# Altium schematic sheet Board baru V.3.SchDoc
size A3
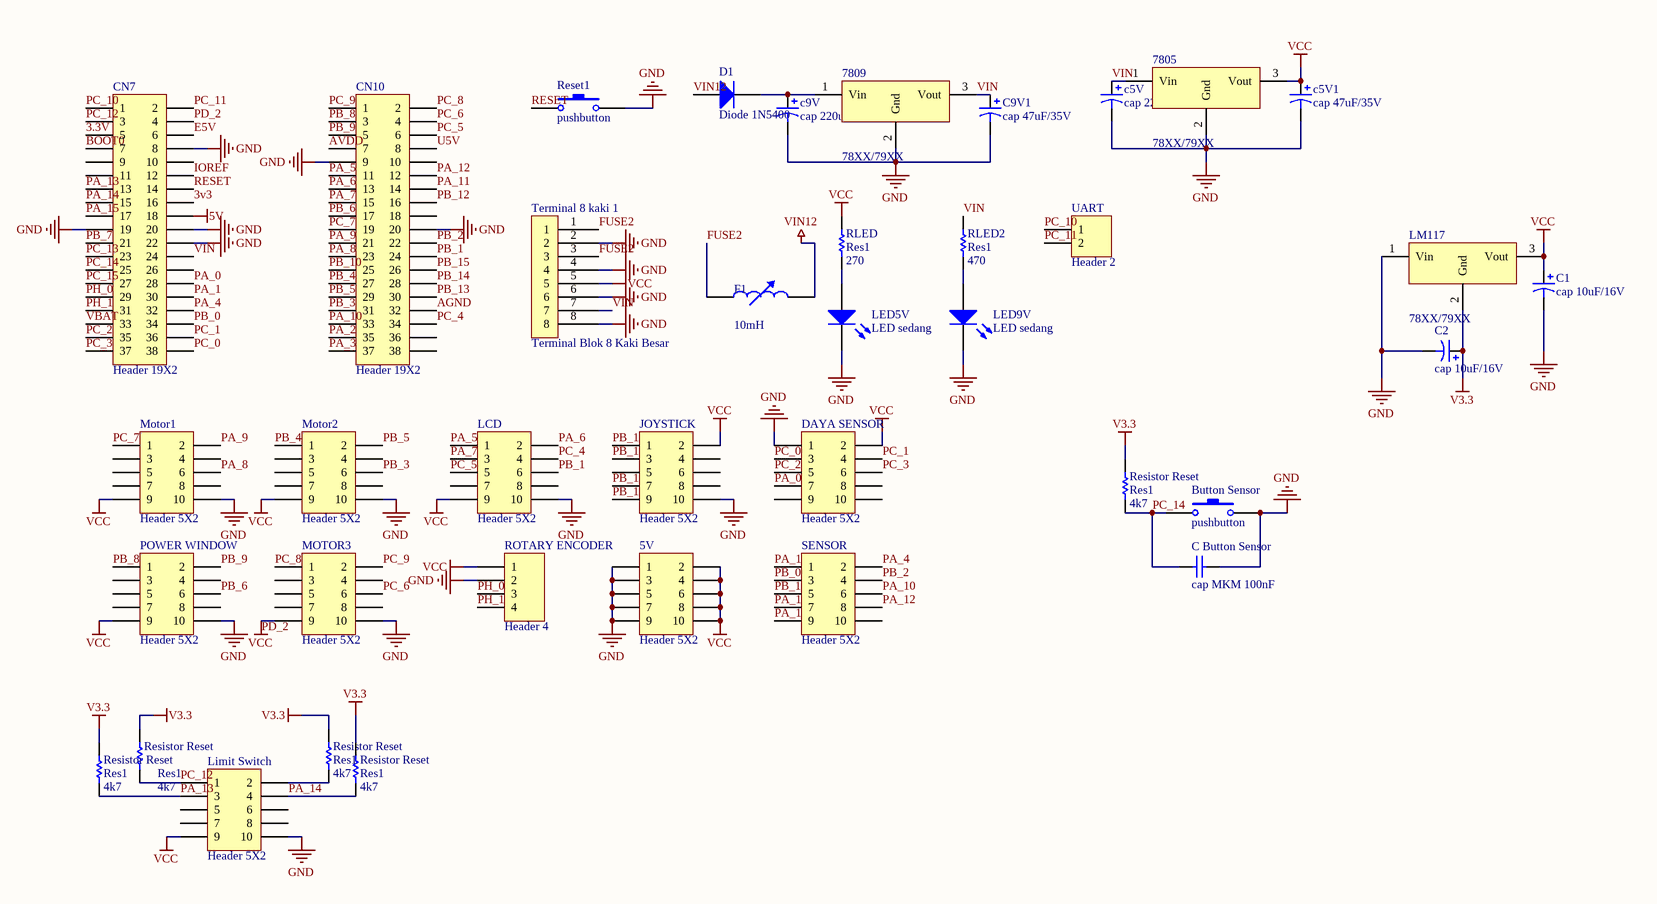
[diagram p0: Board baru V.3.SchDoc]

## Parts
(Parts that share a designator on the sheet are numbered #1, #2 ... from top to bottom, then left to right.)
5V  Header 5X2  [HDR2X5]
7805  78XX/79XX  [78XX/79XX diri]
7809  78XX/79XX  [78XX/79XX]
Button_Sensor  pushbutton  [pushbutton]
C1  cap 10uF/16V  [cap 10uF/16V]
C2  cap 10uF/16V  [cap 10uF/16V]
c5V  cap 220uF/16V  [cap 220uF/16V]
c5V1  cap 47uF/35V  [cap 220uF/16V]
c9V  cap 220uF/50V  [cap 1uF/50V]
C9V1  cap 47uF/35V  [cap 1uF/50V]
C_Button_Sensor  cap MKM 100nF  [cap MKM 100nF diri]
CN7  Header 19X2  [HDR2X19]
CN10  Header 19X2  [HDR2X19]
D1  Diode 1N5400  [DO-201AD]
DAYA_SENSOR  Header 5X2  [HDR2X5]
F1  value 10mH  [AXIAL-0.8]  (hidden comment: Inductor Adj)
JOYSTICK  Header 5X2  [HDR2X5]
LCD  Header 5X2  [HDR2X5]
LED5V  LED sedang  [LED sedang]
LED9V  LED sedang  [LED sedang]
Limit_Switch  Header 5X2  [HDR2X5]
LM117  78XX/79XX  [78XX/79XX]
Motor1  Header 5X2  [HDR2X5]
Motor2  Header 5X2  [HDR2X5]
MOTOR3  Header 5X2  [HDR2X5]
POWER_WINDOW  Header 5X2  [HDR2X5]
Reset1  pushbutton  [pushbutton]
Resistor_Reset#1  Res1  value 4k7  [AXIAL-0.3]
Resistor_Reset#2  Res1  value 4k7  [AXIAL-0.3]
Resistor_Reset#3  Res1  value 4k7  [AXIAL-0.3]
Resistor_Reset#4  Res1  value 4k7  [AXIAL-0.3]
Resistor_Reset#5  Res1  value 4k7  [AXIAL-0.3]
RLED  Res1  value 270  [AXIAL-0.3]
RLED2  Res1  value 470  [AXIAL-0.3]
ROTARY_ENCODER  Header 4  [HDR1X4]
SENSOR  Header 5X2  [HDR2X5]
Terminal_8_kaki_1  Terminal Blok 8 Kaki Besar  [TERMINAL 8 KAKI]
UART  Header 2  [HDR1X2]

## Nets
5V: CN7.18
GND: 5V.1 5V.3 5V.5 5V.7 5V.9 7805.2(Gnd) 7809.2(Gnd) Button_Sensor.2 C1.2 C2.2 c5V.2 c5V1.2 c9V.2 C9V1.2 C_Button_Sensor.2 CN7.8 CN7.19 CN7.20 CN7.22 CN10.9 CN10.20 DAYA_SENSOR.1 JOYSTICK.10 LCD.10 LED5V.2(K) LED9V.2(K) Limit_Switch.10 LM117.1(Vin) Motor1.10 Motor2.10 MOTOR3.10 POWER_WINDOW.10 Reset1.2 ROTARY_ENCODER.2 Terminal_8_kaki_1.2 Terminal_8_kaki_1.4 Terminal_8_kaki_1.6 Terminal_8_kaki_1.8
V3.3: C2.1 LM117.2(Gnd) Resistor_Reset#1.2 Resistor_Reset#2.2 Resistor_Reset#3.2 Resistor_Reset#4.2 Resistor_Reset#5.2
VCC: 5V.2 5V.4 5V.6 5V.8 5V.10 7805.3(Vout) C1.1 c5V1.1 DAYA_SENSOR.2 JOYSTICK.2 LCD.9 Limit_Switch.9 LM117.3(Vout) Motor1.9 Motor2.9 MOTOR3.9 POWER_WINDOW.9 RLED.2 ROTARY_ENCODER.1 Terminal_8_kaki_1.5
VIN12: D1.1(A) F1.2
3.3V: CN7.5
3v3: CN7.16
AGND: CN10.32
AVDD: CN10.7
BOOT0: CN7.7
E5V: CN7.6
FUSE2: F1.1 Terminal_8_kaki_1.1 Terminal_8_kaki_1.3
IOREF: CN7.12
PA_0: CN7.28 DAYA_SENSOR.7
PA_1: CN7.30 SENSOR.1
PA_2: CN10.35
PA_3: CN10.37
PA_4: CN7.32 SENSOR.2
PA_5: CN10.11 LCD.1
PA_6: CN10.13 LCD.2
PA_7: CN10.15 LCD.3
PA_8: CN10.23 Motor1.6
PA_9: CN10.21 Motor1.2
PA_10: CN10.33 SENSOR.6
PA_11: CN10.14 SENSOR.7
PA_12: CN10.12 SENSOR.8
PA_13: CN7.13 Limit_Switch.3 Resistor_Reset#4.1
PA_14: CN7.15 Limit_Switch.4 Resistor_Reset#5.1
PA_15: CN7.17 SENSOR.9
PB_0: CN7.34 SENSOR.3
PB_1: CN10.24 LCD.6
PB_2: CN10.22 SENSOR.4
PB_3: CN10.31 Motor2.6
PB_4: CN10.27 Motor2.1
PB_5: CN10.29 Motor2.2
PB_6: CN10.17 POWER_WINDOW.6
PB_7: CN7.21
PB_8: CN10.3 POWER_WINDOW.1
PB_9: CN10.5 POWER_WINDOW.2
PB_10: CN10.25 SENSOR.5
PB_12: CN10.16 JOYSTICK.3
PB_13: CN10.30 JOYSTICK.7
PB_14: CN10.28 JOYSTICK.9
PB_15: CN10.26 JOYSTICK.1
PC_0: CN7.38 DAYA_SENSOR.3
PC_1: CN7.36 DAYA_SENSOR.4
PC_2: CN7.35 DAYA_SENSOR.5
PC_3: CN7.37 DAYA_SENSOR.6
PC_4: CN10.34 LCD.4
PC_5: CN10.6 LCD.5
PC_6: CN10.4 MOTOR3.6
PC_7: CN10.19 Motor1.1
PC_8: CN10.2 MOTOR3.1
PC_9: CN10.1 MOTOR3.2
PC_10: CN7.1 UART.1
PC_11: CN7.2 UART.2
PC_12: CN7.3 Limit_Switch.1 Resistor_Reset#2.1
PC_13: CN7.23
PC_14: Button_Sensor.1 C_Button_Sensor.1 CN7.25 Resistor_Reset#1.1
PC_15: CN7.27
PD_2: CN7.4
PH_0: CN7.29 ROTARY_ENCODER.3
PH_1: CN7.31 ROTARY_ENCODER.4
RESET: CN7.14 Reset1.1
U5V: CN10.8
VBAT: CN7.33
VIN: 7805.1(Vin) 7809.3(Vout) c5V.1 C9V1.1 CN7.24 RLED2.2 Terminal_8_kaki_1.7
Net7809_1: 7809.1(Vin) c9V.1 D1.2(K)
NetLED5V_1: LED5V.1(A) RLED.1
NetLED9V_1: LED9V.1(A) RLED2.1
NetLimit_Switch_2: Limit_Switch.2 Resistor_Reset#3.1

Not connected (* = marked no-connect by the designer): CN7 9 10 11 26; CN10 10 18 36 38; DAYA_SENSOR 8 9 10; JOYSTICK 4 5 6 8; LCD 7 8; Limit_Switch 5 6 7 8; Motor1 3 4 5 7 8; Motor2 3 4 5 7 8; MOTOR3 3 4 5 7 8; POWER_WINDOW 3 4 5 7 8; SENSOR 10

## Notes on the sheet
- Labels drawn without touching a wire or pin: PD_2
- Title
- Size:
- Date:
- A3
- Number:
- Time:
- Revision:
- Sheet
- of
- File:

## Library data of the parts
5V DAYA_SENSOR JOYSTICK LCD Limit_Switch Motor1 Motor2 MOTOR3 POWER_WINDOW SENSOR = Header 5X2: Header, 5-Pin, Dual row; LatestRevisionDate: 17-Jul-2002; LatestRevisionNote: Re-released for DXP Platform.; Publisher: Altium Limited
7805 7809 LM117 = 7805/7809/7812/7905/7909/7912
c5V1 = cap 220uF/16V
c9V C9V1 = cap 1uF/50V
CN7 CN10 = Header 19X2: Header, 19-Pin, Dual row; LatestRevisionDate: 17-Jul-2002; LatestRevisionNote: Re-released for DXP Platform.; Publisher: Altium Limited
D1 = Diode 1N5400: 3 Amp General Purpose Rectifier; Published: 8-Jun-2000; LatestRevisionDate: 17-Jul-2002; LatestRevisionNote: Re-released for DXP Platform.; DatasheetVersion: 1998; PackageVersion: Aug-1999; PackageReference: DO-201AD; Publisher: Altium Limited; PackageDescription: Diode, Axial; Body 9.5 x 5.6 mm (LxDia. max), Lead Dia. 1.32 mm (max); ComponentLink1Description: Manufacturer Link; ComponentLink1URL: http://www.fairchildsemi.com/; ComponentLink2Description: Datasheet; ComponentLink2URL: http://www.fairchildsemi.com/ds/1N%2F1N5400.pdf
F1 = Inductor Adj: Adjustable Inductor; Set Position: 0.5; Published: 24-Mar-1999; LatestRevisionDate: 17-Jul-2002; LatestRevisionNote: Re-released for DXP Platform.; PackageReference: AXIAL-0.8; Publisher: Altium Limited
Resistor_Reset#1-Resistor_Reset#5 RLED RLED2 = Res1: Resistor; Published: 8-Jun-2000; LatestRevisionDate: 17-Jul-2002; LatestRevisionNote: Re-released for DXP Platform.; PackageReference: AXIAL-0.3; Publisher: Altium Limited
ROTARY_ENCODER = Header 4: Header, 4-Pin; LatestRevisionDate: 17-Jul-2002; LatestRevisionNote: Re-released for DXP Platform.; Publisher: Altium Limited
Terminal_8_kaki_1 = Terminal Block 8 kaki
UART = Header 2: Header, 2-Pin; LatestRevisionDate: 17-Jul-2002; LatestRevisionNote: Re-released for DXP Platform.; Publisher: Altium Limited